# EasyEDA Pro project AmpBoard64TP.eprj, schematic Schematic1
Create Date: 2023-12-29; Page Name: P1; Project Name: Driver64TP; Schematic Name: Schematic1; Update Date: 2023-12-29; Company: EasyEDA.com; Drawed: EasyEDA Pro; Page Size: A4; Part Number: JLCPCB-002; Reviewed: EasyEDA Pro; Version: V0.1
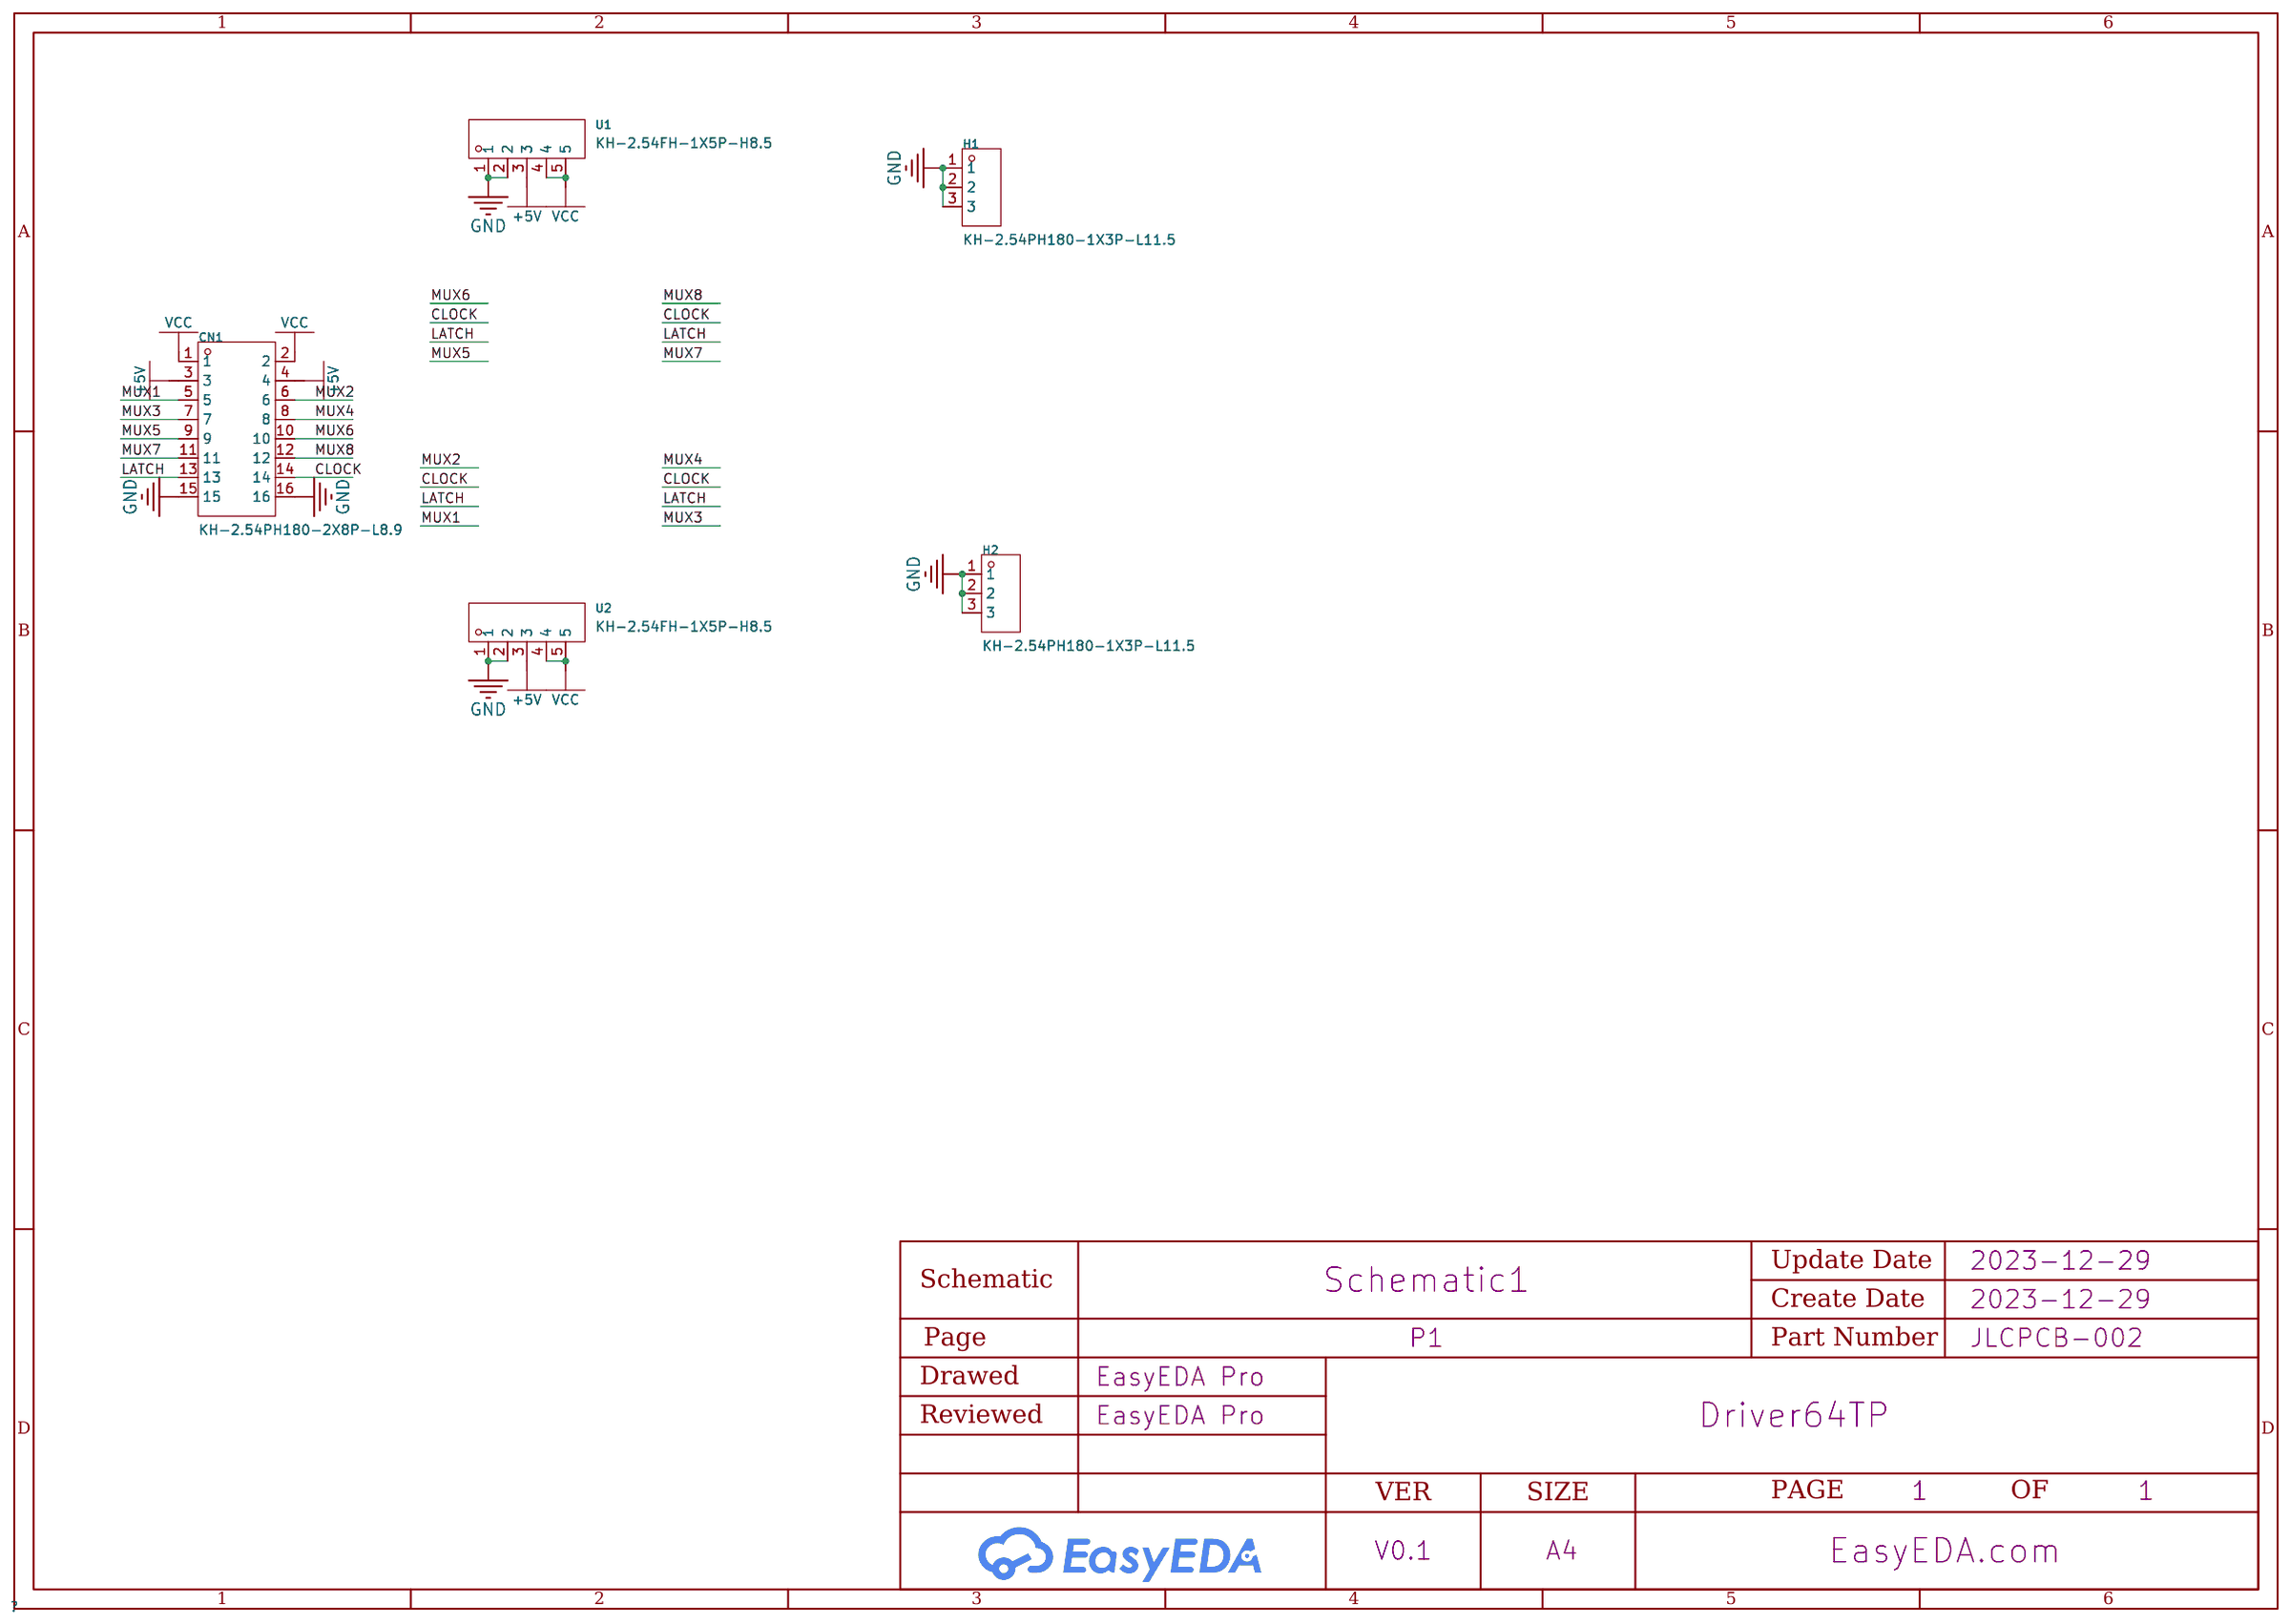
[diagram p0: schematic sheet]

## Parts
CBB1  -
CBB2  -
CBB4  -
CBB5  -
CN1  KH-2.54PH180-2X8P-L8.9  [CONN-TH_16P-P2.54_KINGHELM_KH-2.54PH180-2X8P-L8.9]
H1  KH-2.54PH180-1X3P-L11.5  [HDR-TH_3P-P2.54-V-M]
H2  KH-2.54PH180-1X3P-L11.5  [HDR-TH_3P-P2.54-V-M]
U1  KH-2.54FH-1X5P-H8.5  [HDR-TH_5P-P2.54-V-F]
U2  KH-2.54FH-1X5P-H8.5  [HDR-TH_5P-P2.54-V-F]

## Library data of the parts
CN1 = KH-2.54PH180-2X8P-L8.9: Connector Type:简牛座 Pitch:2.54mm Structure:2x8P Holder Type:Straight Number of Rows:2 Pin Number in each Row:8; LCSC Part Name: 2.54mm 2x8P 排数:2 每排P数:8; Supplier Part: C5157631; Manufacturer: kinghelm(金航标); Supplier Footprint: 插件,P=2.54mm; JLCPCB Part Class: Extended Part; Datasheet: https://atta.szlcsc.com/upload/public/pdf/source/20220902/BDDF6E62C6922AC108506376901906B3.pdf; Supplier: LCSC; Connector Type: 简牛座; Pitch: 2.54mm; Structure: 2x8P; Holder Type: Straight; Number of Rows: 2; Pin Number in each Row: 8
H1 H2 = KH-2.54PH180-1X3P-L11.5: Pin Structure:1x3P Pitch:2.54mm Number of Pins:3P Mounting Type:Straight Number of Rows:Plugin Row Spacing:- Circluar Pins/Square Pins:Square Pins Current Rating (Max):3A Voltage Rating (Max):- Length of Mating Pin:6mm Insulation Height:2.5mm Length of En; LCSC Part Name: 间距:2.54mm 1x3P 直插 方针; Supplier Part: C2932698; Manufacturer: kinghelm(金航标); Supplier Footprint: 插件,P=2.54mm; JLCPCB Part Class: Extended Part; Datasheet: https://atta.szlcsc.com/upload/public/pdf/source/20211220/D2AB060C07EA7DD91A5B4AA994AB98CA.pdf; Supplier: LCSC; Pin Structure: 1x3P; Pitch: 2.54mm; Number of Pins: 3P; Mounting Type: Straight; Number of Rows: Plugin; Circluar Pins/Square Pins: Square Pins; Current Rating (Max): 3A; Length of Mating Pin: 6mm; Insulation Height: 2.5mm; Length of End Connection Pin: 3mm; Operating Temperature Range: -40℃~+105℃; Color: Black
U1 U2 = KH-2.54FH-1X5P-H8.5: Holes Structure:1x5P Pitch:2.54mm Number of Holes:5P Mounting Type:Straight Number of Rows:Plugin Row Spacing:- Circular Hole / Square Hole:Square Holes Current Rating (Max):3A Voltage Rating (Max):- Holes Direction:Top Insulation Height:8.5mm Operating T; LCSC Part Name: 间距:2.54mm 1x5P 直插; Supplier Part: C2932671; Manufacturer: kinghelm(金航标); Supplier Footprint: 插件,P=2.54mm; JLCPCB Part Class: Extended Part; Datasheet: https://atta.szlcsc.com/upload/public/pdf/source/20211220/713781C6F5C85DF868074A0868CC3F7F.pdf; Supplier: LCSC; Holes Structure: 1x5P; Pitch: 2.54mm; Number of Holes: 5P; Mounting Type: Straight; Number of Rows: Plugin; Circular Hole / Square Hole: Square Holes; Current Rating (Max): 3A; Holes Direction: Top; Insulation Height: 8.5mm; Operating Temperature Range: -40℃~+105℃

## Nets
+5V: CN1.3 CN1.4 U1.3 U2.3
GND: CN1.15 CN1.16 H1.1 H1.2 H1.3 H2.1 H2.2 H2.3 U1.1 U1.2 U2.1 U2.2
VCC: CN1.1 CN1.2 U1.4 U1.5 U2.4 U2.5
CLOCK: CBB1.(muxB) CBB2.(muxB) CBB4.(muxB) CBB5.(muxB) CN1.5 CN1.6 CN1.7 CN1.8 CN1.9 CN1.10 CN1.11 CN1.12 CN1.13 CN1.14
